# EAGLE design ShittyPanel (EAGLE 9.1.3)
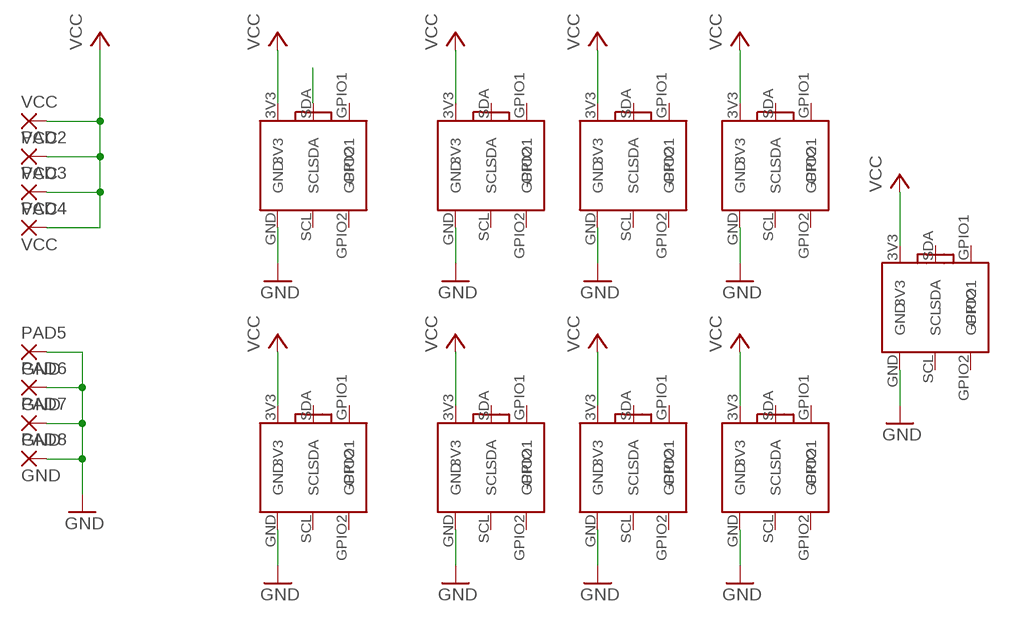
[diagram p0: schematic, sheet 1]

## Parts
PAD2  VCC  SMD5  [SMD2,54-5,08]
PAD3  VCC  SMD5  [SMD2,54-5,08]
PAD4  VCC  SMD5  [SMD2,54-5,08]
PAD5  GND  SMD5  [SMD2,54-5,08]
PAD6  GND  SMD5  [SMD2,54-5,08]
PAD7  GND  SMD5  [SMD2,54-5,08]
PAD8  GND  SMD5  [SMD2,54-5,08]
U$1  SHITTYADDON2  [SHITTYADDON2]
U$2  SHITTYADDON2  [SHITTYADDON2]
U$3  SHITTYADDON2  [SHITTYADDON2]
U$4  SHITTYADDON2  [SHITTYADDON2]
U$5  SHITTYADDON2  [SHITTYADDON2]
U$6  SHITTYADDON2  [SHITTYADDON2]
U$7  SHITTYADDON2  [SHITTYADDON2]
U$8  SHITTYADDON2  [SHITTYADDON2]
U$9  SHITTYADDON2  [SHITTYADDON2]
VCC  VCC  SMD5  [SMD2,54-5,08]

## Nets
GND: PAD5.1(P) PAD6.1(P) PAD7.1(P) PAD8.1(P) U$1.GND U$2.GND U$3.GND U$4.GND U$5.GND U$6.GND U$7.GND U$8.GND U$9.GND
N$1: U$1.SDA
VCC: PAD2.1(P) PAD3.1(P) PAD4.1(P) U$1.3V3 U$2.3V3 U$3.3V3 U$4.3V3 U$5.3V3 U$6.3V3 U$7.3V3 U$8.3V3 U$9.3V3 VCC.1(P)
Unconnected: U$1.GPIO1 U$1.GPIO2 U$1.SCL U$2.GPIO1 U$2.GPIO2 U$2.SCL U$2.SDA U$3.GPIO1 U$3.GPIO2 U$3.SCL U$3.SDA U$4.GPIO1 U$4.GPIO2 U$4.SCL U$4.SDA U$5.GPIO1 U$5.GPIO2 U$5.SCL U$5.SDA U$6.GPIO1 U$6.GPIO2 U$6.SCL U$6.SDA U$7.GPIO1 U$7.GPIO2 U$7.SCL U$7.SDA U$8.GPIO1 U$8.GPIO2 U$8.SCL U$8.SDA U$9.GPIO1 U$9.GPIO2 U$9.SCL U$9.SDA

## Library data of the parts
PAD2-PAD8 VCC = wirepad:SMD5: SMD PAD
U$1-U$9 = Benchoff:SHITTYADDON2

## Board
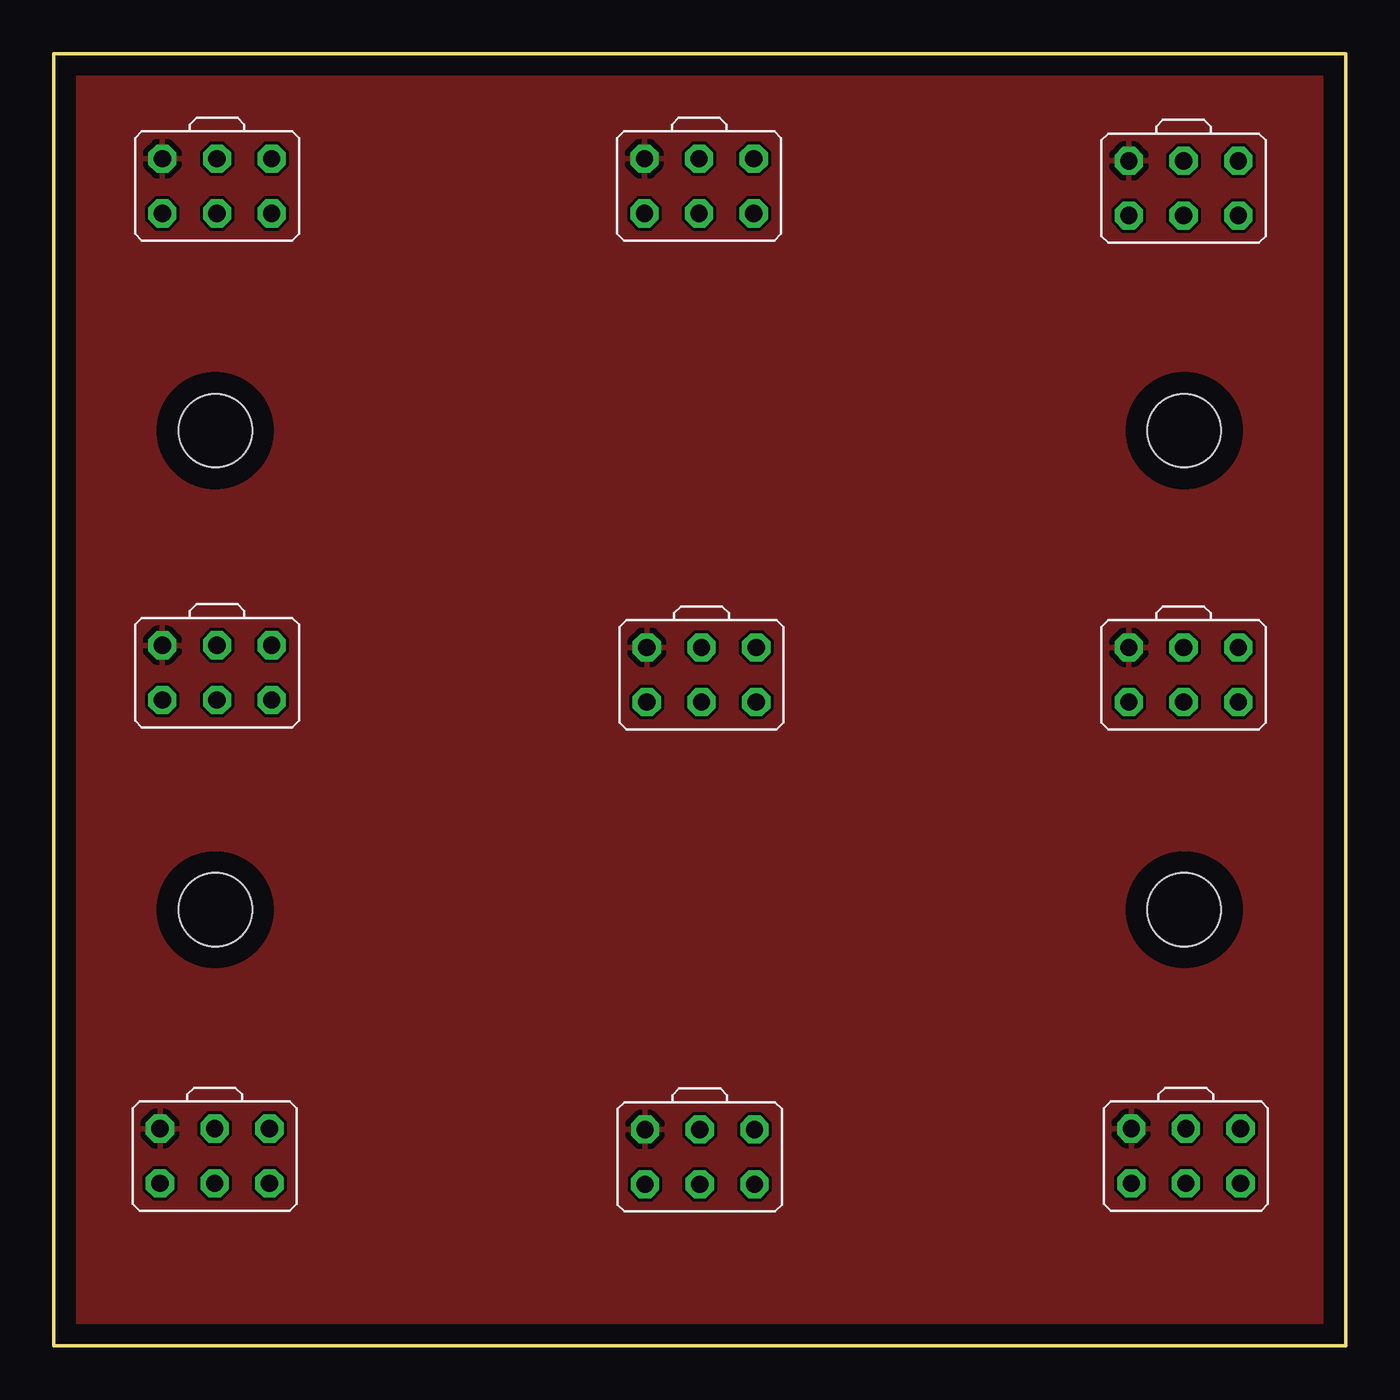
[diagram p1: board, top side]
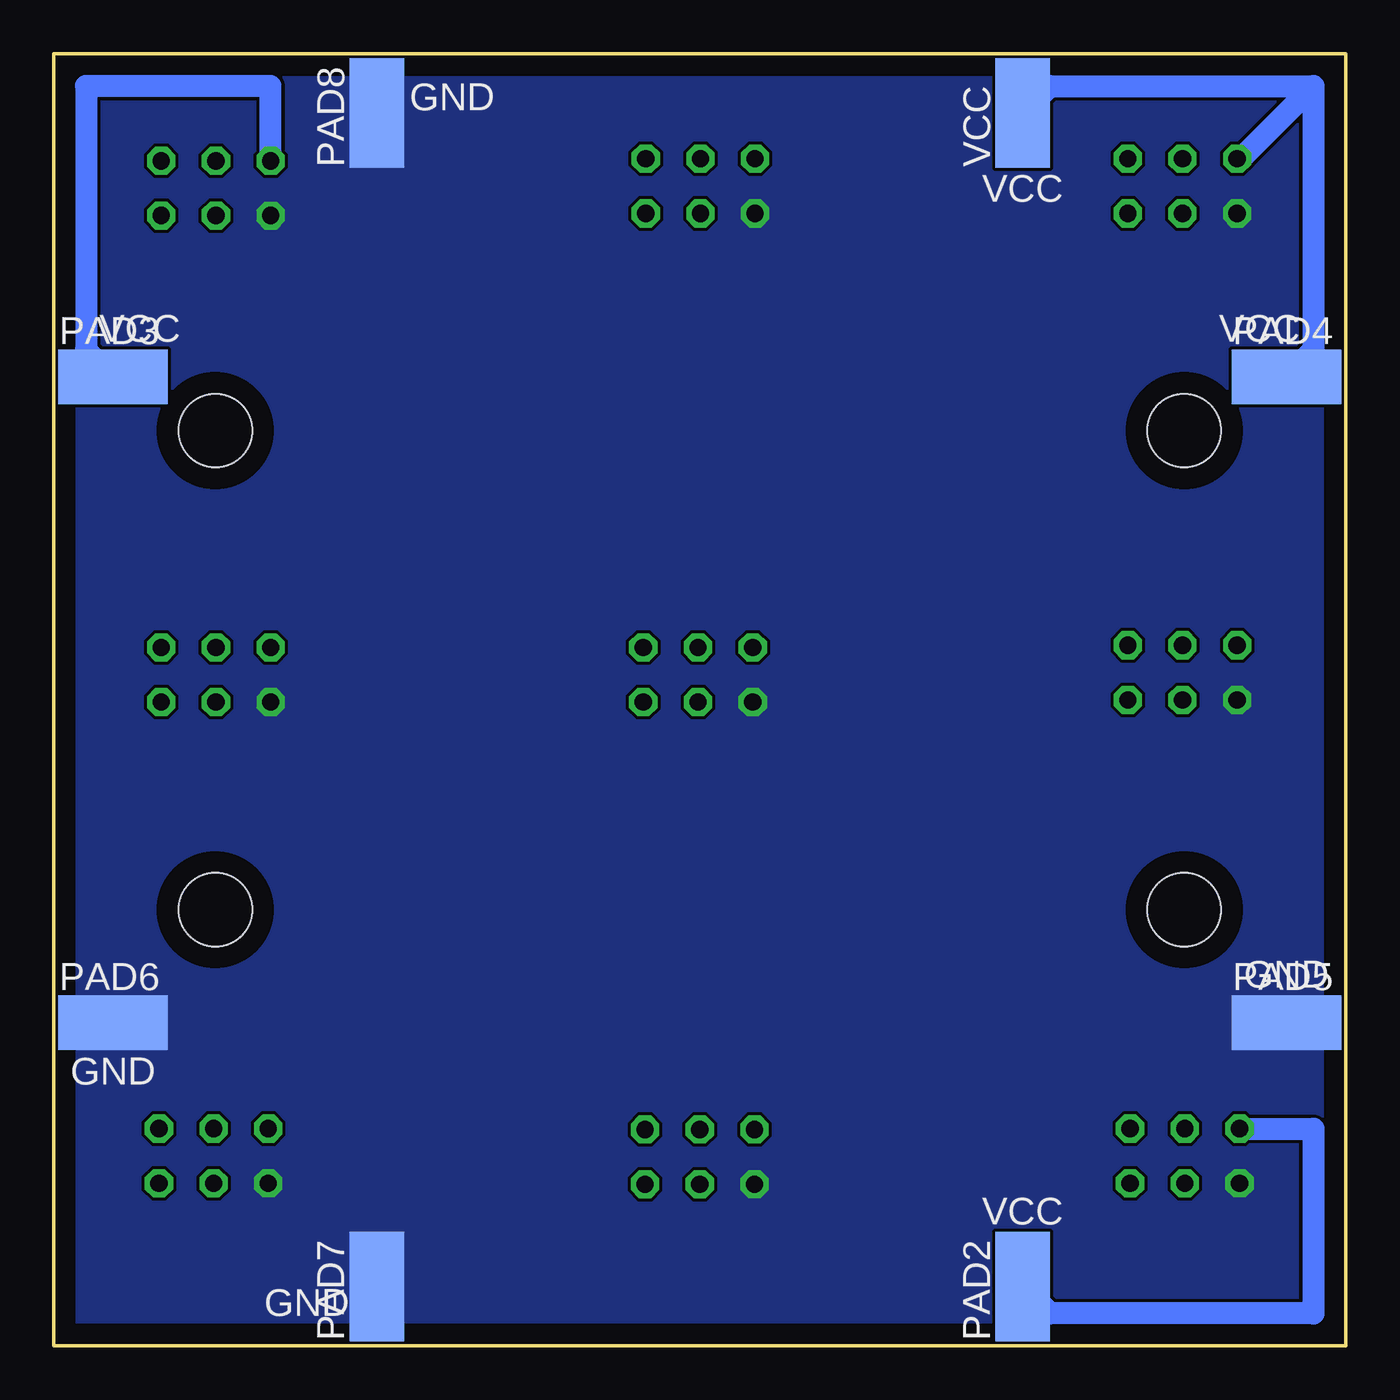
[diagram p2: board, bottom side, seen from below]

Size 60 x 60 mm. Coordinates in mm from the lower left corner, seen from the top.
Outline: 0,0 60,0 60,60 0,60 0,0
Copper layers (1*16): Top 0.035mm / dielectric 1.5mm / Bottom 0.035mm
Design rules "default": minimum track width 6mil, minimum drill 0.35mm, track to track 6mil, track to pad 6mil, pad to pad 6mil, via to via 6mil, smd to smd 6mil, copper to edge 40mil, drill to drill 6mil, minimum pad ring 10mil, minimum via ring 8mil, stop-mask expansion 4mil, vias tented up to drill 0mil, thermal gap 10mil
Holes 3.4 mm at 7.5,20.25 52.5,20.25 52.5,42.5 7.5,42.5
Milling: 4 lines

### Footprints (pad centres in the part's own frame; a part is rotated, then mirrored left to right if it is on the bottom)
SMD2,54-5,08 = smd 2.54 x 5.08: 1 0,0
SHITTYADDON2 = drill 0.8 octagon: 3V3 -2.54,2.54; GND -2.54,0; GPIO1 2.54,2.54; GPIO2 2.54,0; SCL 0,0; SDA 0,2.54

### Placement (x,y rotation side)
PAD2  15,2.75 0 bottom
PAD3  57.25,45 270 bottom
PAD4  2.75,45 270 bottom
PAD5  2.75,15 270 bottom
PAD6  57.25,15 270 bottom
PAD7  45,2.75 0 bottom
PAD8  45,57.25 0 bottom
U$1  7.47,7.54 0 top
U$2  52.58,7.54 0 top
U$3  52.47,29.89 0 top
U$4  30.08,29.89 0 top
U$5  52.47,52.49 0 top
U$6  7.58,29.99 0 top
U$7  29.97,52.59 0 top
U$8  7.58,52.59 0 top
U$9  30,7.5 0 top
VCC  15,57.25 0 bottom

### Tracks (layer width: path | path; a pad name or v marks a point on that pad's centre or on a via)
GND
  pour Bottom (no thermals): 0,60 60,60 60,0 0,0
VCC
  Bottom 1.016: 1.5,58.5 13.75,58.5 VCC.1 | U$8.3V3 4.87,55.13 2.75,57.25 1.75,58.25 1.5,58.5 | U$5.3V3 49.93,58.5 58.5,58.5 58.5,46.25 PAD3.1 | U$1.3V3 1.5,10.08 1.5,1.5 13.75,1.5 PAD2.1 | 1.5,58.5 1.5,46.25 PAD4.1
  pour Top: 0,60 60,60 60,0 0,0

### Text on the board
bPlace: GND | VCC | VCC | VCC | GND | GND | VCC | GND